# Altium schematic sheet passe-bande 5kHz.SchDoc
size A4; SheetNumber: 3; SheetTotal: 4; SPICEModelCacheCRDIFHPZ: <root> / <DocumentId>CRDIFHPZ</DocumentId> / <CacheFrame Number="0"> / <Model Name="ideal" Kind="CKT"> / <Text>*IDEAL:Amplificateur operationnel avec gain boucle ouverte de 100K / .SUBCKT IDEAL 1 2 3 / EGAIN 3 0 1 2 1E5 / .ENDS</Text> / </Model> / </CacheFrame> / </root>
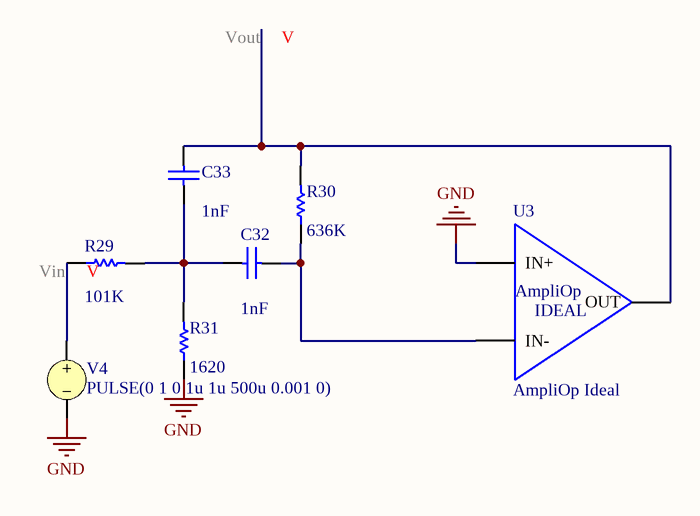
[diagram p0: passe-bande 5kHz.SchDoc]

## Parts
C32  value 1nF  [RAD-0.3]  (hidden comment: Cap)
C33  value 1nF  [RAD-0.3]  (hidden comment: Cap)
R29  value 101K  [AXIAL-0.3]  (hidden comment: Res1)
R30  value 636K  [AXIAL-0.3]  (hidden comment: Res1)
R31  value 1620  [AXIAL-0.3]  (hidden comment: Res1)
U3  AmpliOp Ideal
V4  PULSE(0 1 0 1u 1u 500u 0.001 0)

## Nets
GND: R31.1 U3.1(IN+) V4.2
NetC32_1: C32.1 C33.1 R29.2 R31.2
NetC32_2: C32.2 R30.1 U3.2(IN-)
NetC33_2: C33.2 R30.2 U3.3(OUT)
NetR29_1: R29.1 V4.1

## Notes on the sheet
- (in symbol AmpliOp_ideal) AmpliOp; IDEAL

## Library data of the parts
C32 C33 = Cap: Capacitor; Published: 8-Jun-2000; LatestRevisionDate: 17-Jul-2002; LatestRevisionNote: Re-released for DXP Platform.; PackageReference: RAD-0.3; Publisher: Altium Limited; PackageDescription: Radial Cap, Thru-Hole; 2 Leads; 0.3 in Pin Spacing
R29-R31 = Res1: Resistor; Published: 8-Jun-2000; LatestRevisionDate: 17-Jul-2002; LatestRevisionNote: Re-released for DXP Platform.; PackageReference: AXIAL-0.3; Publisher: Altium Limited; PackageDescription: Axial Device, Thru-Hole; 2 Leads; 0.3 in Pin Spacing
U3 = AmpliOp_ideal
V4 = VSRC: Voltage Source; Note: PCB Footprint - Not required; DC Magnitude: 1; AC Phase: 0; Period: 0.001; Published: 8-Jun-2000; LatestRevisionDate: 17-Jul-2002; LatestRevisionNote: Re-released for DXP Platform.; PackageReference: Not Applicable; Publisher: Altium Limited; AC Magnitude: 1; Initial Value: 0; Pulsed Value: 1; Time Delay: 0; Rise Time: 1u; Fall Time: 1u; Pulse Width: 500u; Phase: 0